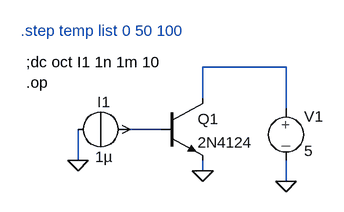
[diagram p0: schematic beta-kennlininie1.asc]
beta-kennlininie1.asc, the LTspice schematic file:
Version 4
SHEET 1 880 680
WIRE 416 80 288 80
WIRE 288 128 288 80
WIRE 416 144 416 80
WIRE 224 176 176 176
WIRE 96 224 96 176
WIRE 288 240 288 224
WIRE 416 256 416 224
FLAG 288 240 0
FLAG 416 256 0
FLAG 96 224 0
SYMBOL EIT_Semiconductors\\npn 224 128 R0
SYMATTR InstName Q1
SYMATTR Value 2N4124
SYMBOL source-V 416 128 R0
SYMATTR InstName V1
SYMATTR Value 5
SYMBOL source-I 176 176 R90
WINDOW 0 -27 40 VBottom 2
WINDOW 3 27 40 VTop 2
SYMATTR InstName I1
SYMATTR Value 1µ
TEXT 16 72 Left 2 !;dc oct I1 1n 1m 10
TEXT 8 24 Left 2 ;.step temp list 0 50 100
TEXT 16 104 Left 2 !.op

The netlist it stands for:
* beta-kennlininie1.asc
Q1 N001 N002 0 0 2N4124
V1 N001 0 5
I1 0 N002 1µ
.model NPN NPN
.model PNP PNP
.lib standard.bjt
;dc oct I1 1n 1m 10
* .step temp list 0 50 100
.op
.backanno
.end